# Altium schematic sheet R3S601.SchDoc
size A3
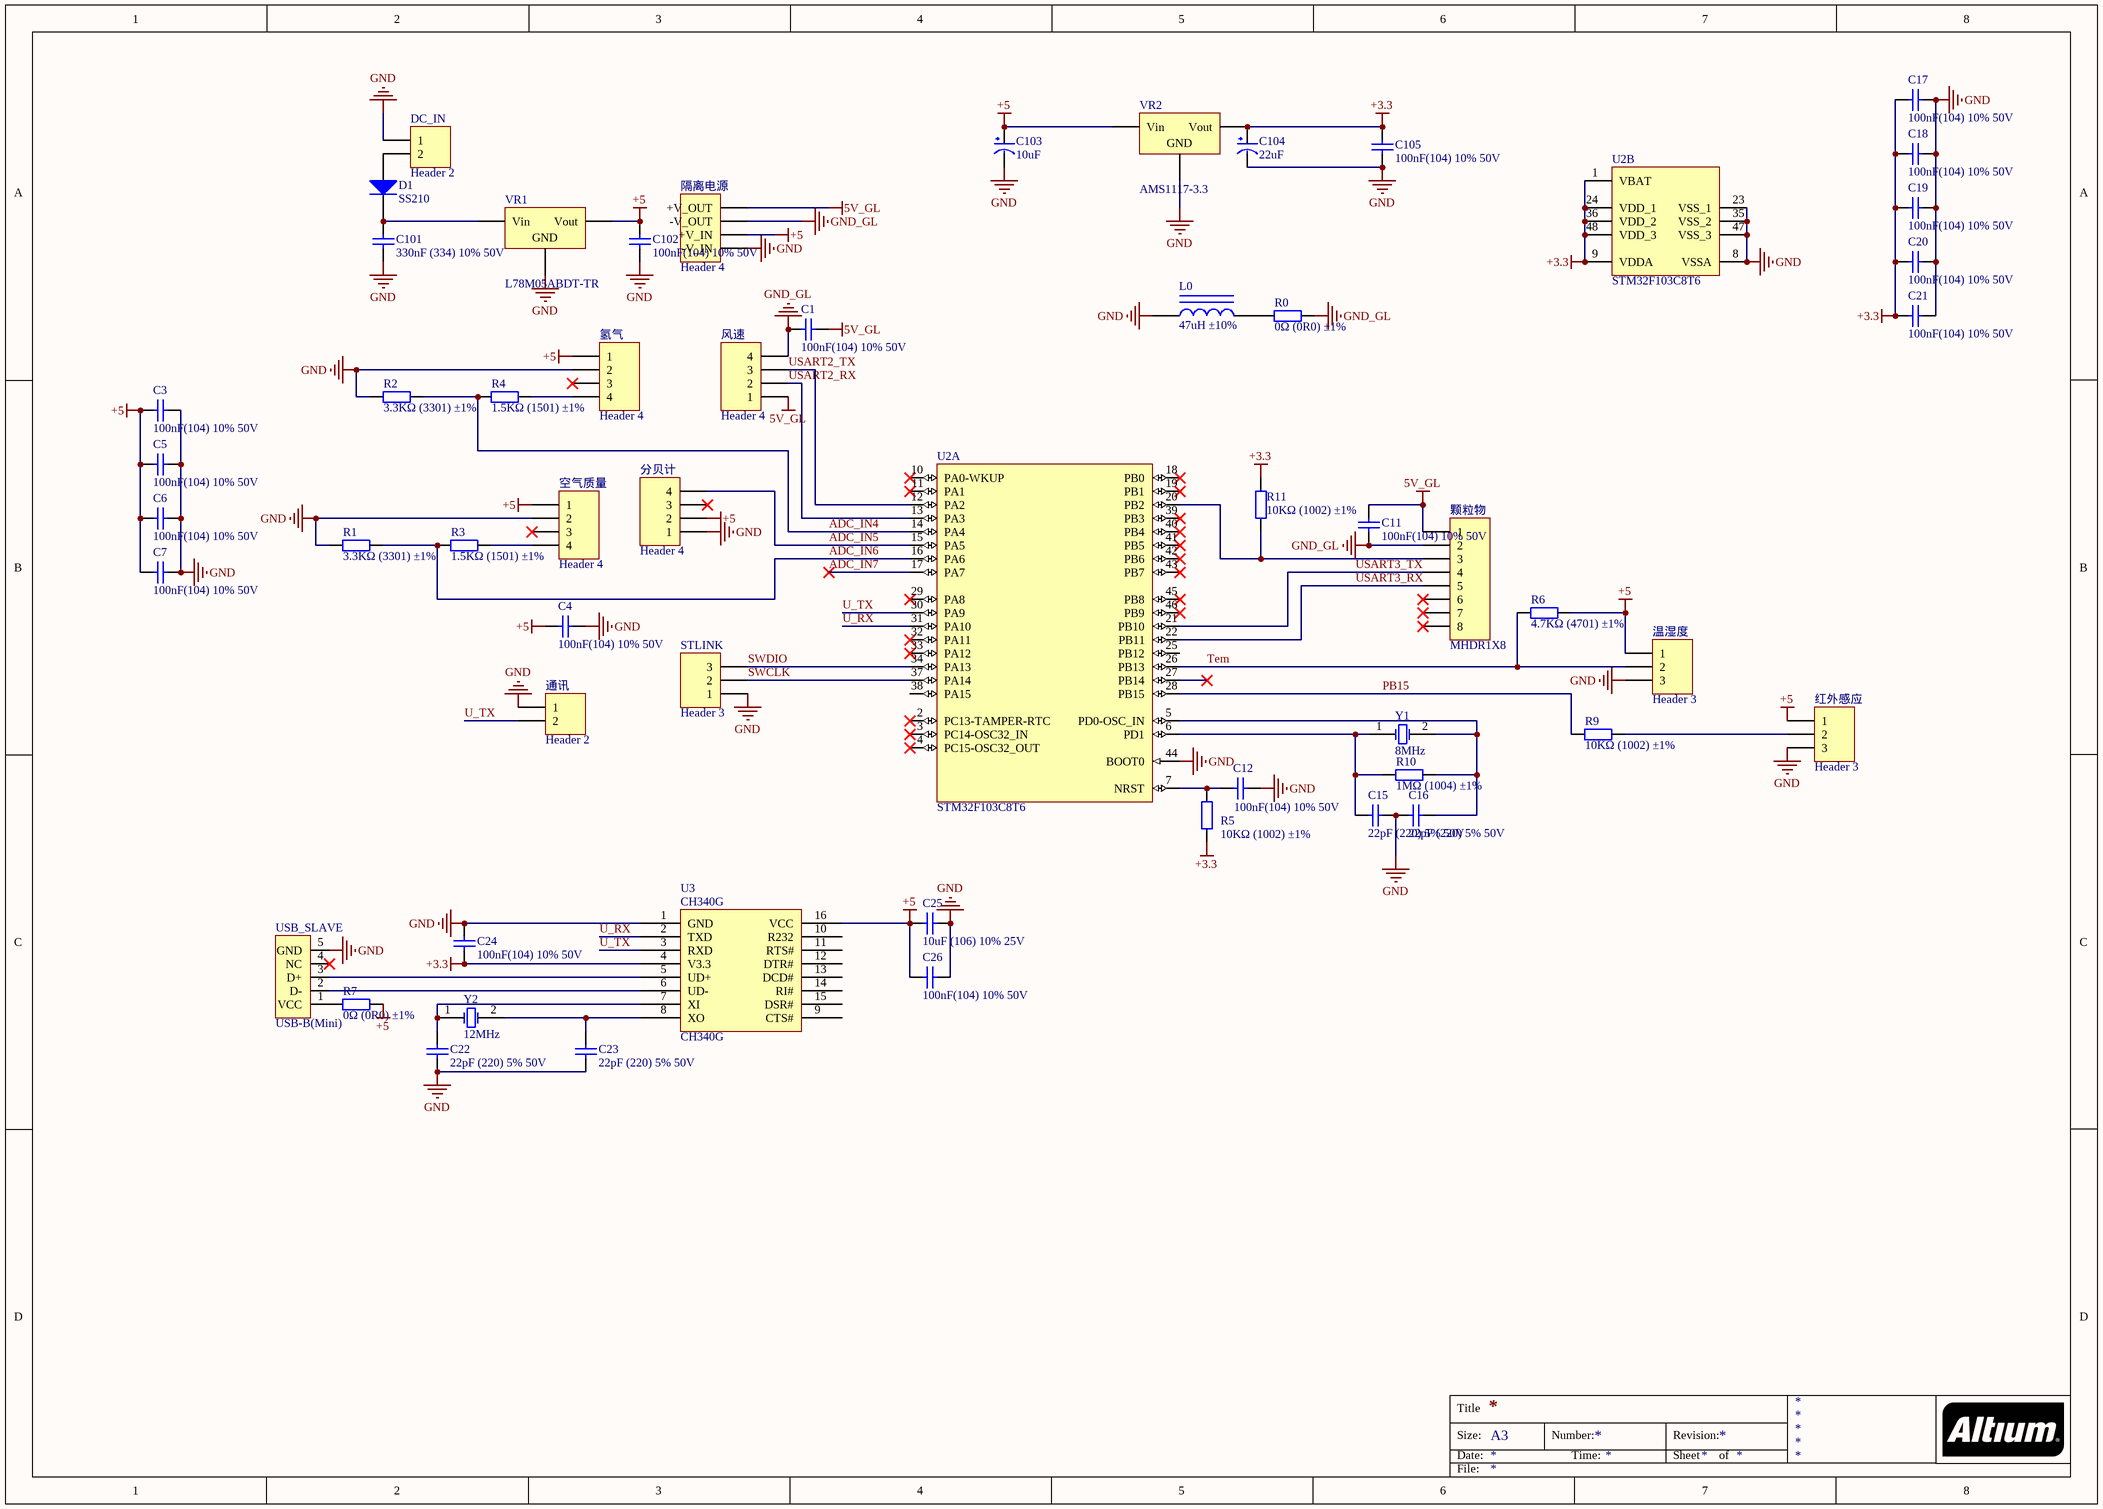
[diagram p0: R3S601.SchDoc]

## Parts
C1  100nF(104) 10% 50V  [LC-0805_C]
C3  100nF(104) 10% 50V  [LC-0805_C]
C4  100nF(104) 10% 50V  [LC-0805_C]
C5  100nF(104) 10% 50V  [LC-0805_C]
C6  100nF(104) 10% 50V  [LC-0805_C]
C7  100nF(104) 10% 50V  [LC-0805_C]
C11  100nF(104) 10% 50V  [LC-0805_C]
C12  100nF(104) 10% 50V  [LC-0805_C]
C15  22pF (220) 5% 50V  [LC-0805_C]
C16  22pF (220) 5% 50V  [LC-0805_C]
C17  100nF(104) 10% 50V  [LC-0805_C]
C18  100nF(104) 10% 50V  [LC-0805_C]
C19  100nF(104) 10% 50V  [LC-0805_C]
C20  100nF(104) 10% 50V  [LC-0805_C]
C21  100nF(104) 10% 50V  [LC-0805_C]
C22  22pF (220) 5% 50V  [LC-0805_C]
C23  22pF (220) 5% 50V  [LC-0805_C]
C24  100nF(104) 10% 50V  [LC-0805_C]
C25  10uF (106) 10% 25V  [LC-0805_C]
C26  100nF(104) 10% 50V  [LC-0805_C]
C101  330nF (334) 10% 50V  [LC-0805_C]
C102  100nF(104) 10% 50V  [LC-0805_C]
C103  10uF  [CC6.56.5]
C104  22uF  [CC6.56.5]
C105  100nF(104) 10% 50V  [LC-0805_C]
D1  SS210  [LC-SMA(DO-214AC)_S1]
DC_IN  Header 2  [HDR1X2]
L0  47uH ±10%  [LC-0805_L]
R0  0Ω (0R0) ±1%  [LC-0603_R]
R1  3.3KΩ (3301) ±1%  [LC-0805_R]
R2  3.3KΩ (3301) ±1%  [LC-0805_R]
R3  1.5KΩ (1501) ±1%  [LC-0805_R]
R4  1.5KΩ (1501) ±1%  [LC-0805_R]
R5  10KΩ (1002) ±1%  [LC-0805_R]
R6  4.7KΩ (4701) ±1%  [LC-0805_R]
R7  0Ω (0R0) ±1%  [LC-0805_R]
R9  10KΩ (1002) ±1%  [LC-0805_R]
R10  1MΩ (1004) ±1%  [LC-0805_R]
R11  10KΩ (1002) ±1%  [LC-0805_R]
STLINK  Header 3  [HDR1X3]
U2  STM32F103C8T6  [LC-LQFP-48_7x7x05P]  (parts A,B of 2)
U3  CH340G  [LC-SOIC-16_150mil]
USB_SLAVE  USB-B(Mini)  [USB/SM0.8-6H5]
VR1  L78M05ABDT-TR  [LC-TO-252-2-180]
VR2  AMS1117-3.3  [LC-SOT-223]
Y1  8MHz  [XTAL_US]
Y2  12MHz  [XTAL_US]
分贝计  Header 4  [HDR1X4]
氢气  Header 4  [HDR1X4]
温湿度  Header 3  [HDR1X3]
空气质量  Header 4  [HDR1X4]
红外感应  Header 3  [HDR1X3]
通讯  Header 2  [HDR1X2]
隔离电源  Header 4  [HDR1X4]
颗粒物  MHDR1X8  [MHDR1X8]
风速  Header 4  [HDR1X4]

## Nets
5V_GL: C1.2 C11.2 隔离电源.4(+V_OUT) 颗粒物.1 风速.1
+3.3: C17.2 C18.2 C19.2 C20.2 C21.2 C24.1 C104.1(VCC) C105.2 R5.1 R11.2 U2.1(VBAT) U2.9(VDDA) U2.24(VDD_1) U2.36(VDD_2) U2.48(VDD_3) U3.4(V3.3) VR2.2(Vout)
+5: C3.1 C4.1 C5.1 C6.1 C7.1 C25.1 C26.1 C102.2 C103.1(VCC) R6.2 R7.2 U3.16(VCC) VR1.3(Vout) VR2.3(Vin) 分贝计.2 氢气.1 温湿度.1 空气质量.1 红外感应.1 隔离电源.2(+V_IN)
GND: C3.2 C4.2 C5.2 C6.2 C7.2 C12.1 C15.2 C16.1 C17.1 C18.1 C19.1 C20.1 C21.1 C22.1 C23.1 C24.2 C25.2 C26.2 C101.1 C102.1 C103.2(GND) C104.2(GND) C105.1 DC_IN.1 L0.1 R1.1 R2.1 STLINK.1 U2.8(VSSA) U2.23(VSS_1) U2.35(VSS_2) U2.44(BOOT0) U2.47(VSS_3) U3.1(GND) USB_SLAVE.5(GND) VR1.2(GND) VR2.1(GND) 分贝计.1 氢气.2 温湿度.3 空气质量.2 红外感应.3 通讯.1 隔离电源.1(-V_IN)
GND_GL: C1.1 C11.1 R0.2 隔离电源.3(-V_OUT) 颗粒物.2 风速.4
ADC_IN4: R2.2 R4.1 U2.14(PA4)
ADC_IN5: U2.15(PA5) 分贝计.4
ADC_IN6: R1.2 R3.1 U2.16(PA6)
ADC_IN7: U2.17(PA7)
PB15: R9.1 U2.28(PB15)
SWCLK: STLINK.2 U2.37(PA14)
SWDIO: STLINK.3 U2.34(PA13)
Tem: R6.1 U2.26(PB13) 温湿度.2
U_RX: U2.31(PA10) U3.2(TXD)
U_TX: U2.30(PA9) U3.3(RXD) 通讯.2
USART2_RX: U2.13(PA3) 风速.2
USART2_TX: U2.12(PA2) 风速.3
USART3_RX: U2.22(PB11) 颗粒物.5
USART3_TX: U2.21(PB10) 颗粒物.4
NetC12_2: C12.2 R5.2 U2.7(NRST)
NetC15_1: C15.1 R10.1 U2.6(PD1) Y1.1(OSC1)
NetC16_2: C16.2 R10.2 U2.5(PD0-OSC_IN) Y1.2(OSC2)
NetC22_2: C22.2 U3.7(XI) Y2.1(OSC1)
NetC23_2: C23.2 U3.8(XO) Y2.2(OSC2)
NetC101_2: C101.2 D1.2(K) VR1.1(Vin)
NetD1_1: D1.1(A) DC_IN.2
NetL0_2: L0.2 R0.1
NetR3_2: R3.2 空气质量.4
NetR4_2: R4.2 氢气.4
NetR7_1: R7.1 USB_SLAVE.1(VCC)
NetR9_2: R9.2 红外感应.2
NetR11_1: R11.1 U2.20(PB2) 颗粒物.3
NetU3_5: U3.5(UD+) USB_SLAVE.3(D+)
NetU3_6: U3.6(UD-) USB_SLAVE.2(D-)

Not connected (* = marked no-connect by the designer): U2 2(PC13-TAMPER-RTC)* 3(PC14-OSC32_IN)* 4(PC15-OSC32_OUT)* 10(PA0-WKUP)* 11(PA1)* 18(PB0)* 19(PB1)* 25(PB12) 27(PB14)* 29(PA8)* 32(PA11)* 33(PA12)* 38(PA15) 39(PB3)* 40(PB4)* 41(PB5)* 42(PB6)* 43(PB7)* 45(PB8)* 46(PB9)*; U3 9(CTS#) 10(R232) 11(RTS#) 12(DTR#) 13(DCD#) 14(RI#) 15(DSR#); USB_SLAVE 4(NC)*; 分贝计 3*; 氢气 3*; 空气质量 3*; 颗粒物 6* 7* 8*

## Notes on the sheet
- Title
- Size:
- Date:
- A3
- Number:
- Time:
- Revision:
- Sheet
- of
- File:

## Library data of the parts
C1 C3-C7 C11 C12 C17-C21 C24 C26 C102 C105 = 0805 100nF(104) 10% 50V: 贴片电容; ComponentLink1Description: 供应商链接; ComponentLink1URL: http://www.szlcsc.com/product/details_50686.html; Package: 0805; Supplier: LC; SuppliersPartNumber: C49678
C15 C16 C22 C23 = 0805 22pF (220) 5% 50V: 贴片电容; ComponentLink1Description: 供应商链接; ComponentLink1URL: http://www.szlcsc.com/product/details_2156.html; Package: 0805; Supplier: LC; SuppliersPartNumber: C1804
C25 = 0805 10uF (106) 10% 25V: 贴片电容; ComponentLink1Description: 供应商链接; ComponentLink1URL: http://www.szlcsc.com/product/details_16532.html; Package: 0805; Supplier: LC; SuppliersPartNumber: C15850
C101 = 0805 330nF (334) 10% 50V: 贴片电容; ComponentLink1Description: 供应商链接; ComponentLink1URL: http://www.szlcsc.com/product/details_2092.html; Package: 0805; Supplier: LC; SuppliersPartNumber: C1740
C103 C104 = CAP
D1 = SMA(DO-214AC) SS210: 二极管; ComponentLink1Description: 供应商链接; ComponentLink1URL: http://www.szlcsc.com/product/details_15669.html; Package: SMA(DO-214AC); Supplier: LC; SuppliersPartNumber: C14996
DC_IN 通讯 = Header 2: Header, 2-Pin; LatestRevisionDate: 17-Jul-2002; LatestRevisionNote: Re-released for DXP Platform.; Publisher: Altium Limited
L0 = 0805 47uH 10%: 贴片电感; ComponentLink1Description: 供应商链接; ComponentLink1URL: http://www.szlcsc.com/product/details_14964.html; Package: 0805; Supplier: LC; SuppliersPartNumber: C14304
R0 = 0603 0Ω (0R0) 1%: 贴片电阻; ComponentLink1Description: 供应商链接; ComponentLink1URL: http://www.szlcsc.com/product/details_21903.html; Package: 0603; Supplier: LC; SuppliersPartNumber: C21189
R1 R2 = 0805 3.3KΩ (3301) 1%: 贴片电阻; ComponentLink1Description: 供应商链接; ComponentLink1URL: http://www.szlcsc.com/product/details_26753.html; Package: 0805; Supplier: LC; SuppliersPartNumber: C26010
R3 R4 = 0805 1.5KΩ (1501) 1%: 贴片电阻; ComponentLink1Description: 供应商链接; ComponentLink1URL: http://www.szlcsc.com/product/details_4717.html; Package: 0805; Supplier: LC; SuppliersPartNumber: C4310
R5 R9 R11 = 0805 10KΩ (1002) 1%: 贴片电阻; ComponentLink1Description: 供应商链接; ComponentLink1URL: http://www.szlcsc.com/product/details_18102.html; Package: 0805; Supplier: LC; SuppliersPartNumber: C17414
R6 = 0805 4.7KΩ (4701) 1%: 贴片电阻; ComponentLink1Description: 供应商链接; ComponentLink1URL: http://www.szlcsc.com/product/details_18361.html; Package: 0805; Supplier: LC; SuppliersPartNumber: C17673
R7 = 0805 0Ω (0R0) 1%: 贴片电阻; ComponentLink1Description: 供应商链接; ComponentLink1URL: http://www.szlcsc.com/product/details_18165.html; Package: 0805; Supplier: LC; SuppliersPartNumber: C17477
R10 = 0805 1MΩ (1004) 1%: 贴片电阻; ComponentLink1Description: 供应商链接; ComponentLink1URL: http://www.szlcsc.com/product/details_18202.html; Package: 0805; Supplier: LC; SuppliersPartNumber: C17514
STLINK 温湿度 红外感应 = Header 3: Header, 3-Pin; LatestRevisionDate: 17-Jul-2002; LatestRevisionNote: Re-released for DXP Platform.; Publisher: Altium Limited
U2 = STM32F103C8T6: ARM; ComponentLink1Description: 供应商链接; ComponentLink1URL: http://www.szlcsc.com/product/details_9243.html; Package: LQFP-48_7x7x05P; Supplier: LC; SuppliersPartNumber: C8734
U3 = CH340G: USB; ComponentLink1Description: 供应商链接; ComponentLink1URL: http://www.szlcsc.com/product/details_14927.html; Package: SOIC-16_150mil; Supplier: LC; SuppliersPartNumber: C14267
USB_SLAVE = USB5
VR1 = TO-252-2 L78M05ABDT-TR: 低压差线性稳压(LDO); ComponentLink1Description: 供应商链接; ComponentLink1URL: http://www.szlcsc.com/product/details_59107.html; Package: TO-252-2; Supplier: LC; SuppliersPartNumber: C58069
VR2 = SOT-223 AMS1117-3.3: 低压差线性稳压(LDO); ComponentLink1Description: 供应商链接; ComponentLink1URL: http://www.szlcsc.com/product/details_6652.html; Package: SOT-223; Supplier: LC; SuppliersPartNumber: C6186
Y1 Y2 = XTAL: Crystal Oscillator; Published: 8-Jun-2000; LatestRevisionDate: 17-Jul-2002; LatestRevisionNote: Re-released for DXP Platform.; Publisher: Altium Limited
分贝计 氢气 空气质量 隔离电源 风速 = Header 4: Header, 4-Pin; LatestRevisionDate: 17-Jul-2002; LatestRevisionNote: Re-released for DXP Platform.; Publisher: Altium Limited
颗粒物 = MHDR1X8: Header, 8-Pin; LatestRevisionDate: 17-Jul-2002; LatestRevisionNote: Re-released for DXP Platform.; Publisher: Altium Limited